# Altium schematic sheet receiver.SchDoc: MW Bench - Receiver
size A3; Organization: Altium Limited; Address1: L3, 12a Rodborough Rd; Address2: Frenchs Forest; Address3: NSW; Address4: Australia 2086; SheetNumber: 2; SheetTotal: 2
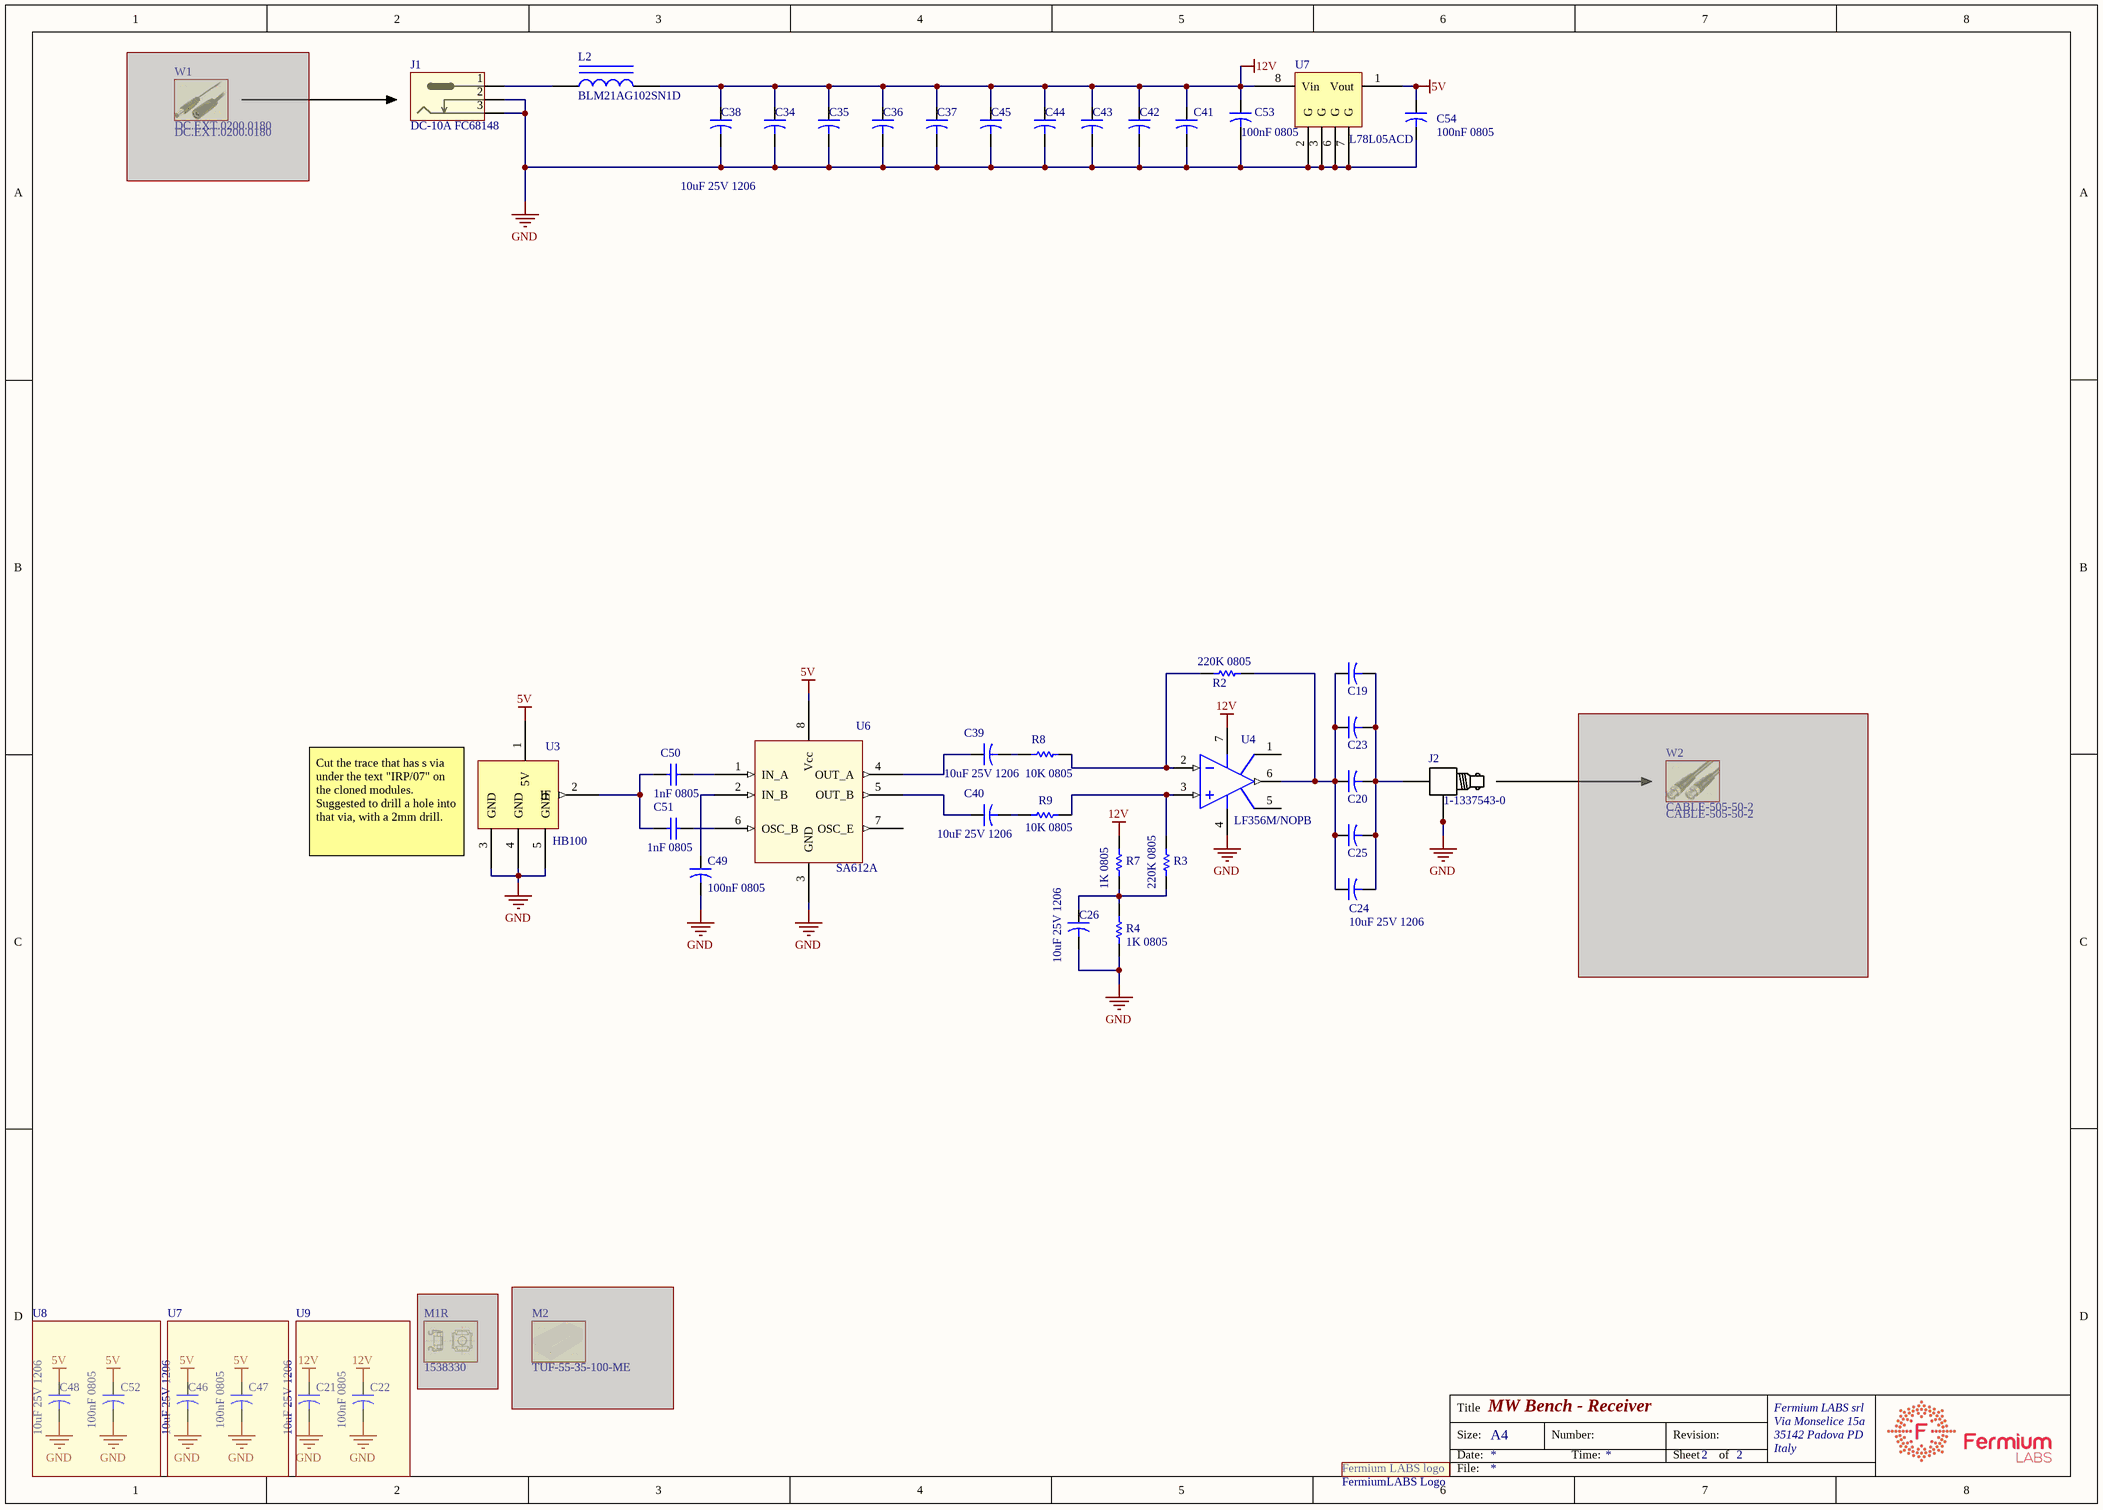
[diagram p0: receiver.SchDoc]

## Parts
C19  10uF 25V 1206  [CAP 1206_3216]  (value not drawn)
C20  10uF 25V 1206  [CAP 1206_3216]  (value not drawn)
C21  10uF 25V 1206  [CAP 1206_3216]
C22  100nF 0805  [CAP 0805_2012]
C23  10uF 25V 1206  [CAP 1206_3216]  (value not drawn)
C24  10uF 25V 1206  [CAP 1206_3216]
C25  10uF 25V 1206  [CAP 1206_3216]  (value not drawn)
C26  10uF 25V 1206  [CAP 1206_3216]
C34  10uF 25V 1206  [CAP 1206_3216]  (value not drawn)
C35  10uF 25V 1206  [CAP 1206_3216]  (value not drawn)
C36  10uF 25V 1206  [CAP 1206_3216]  (value not drawn)
C37  10uF 25V 1206  [CAP 1206_3216]  (value not drawn)
C38  10uF 25V 1206  [CAP 1206_3216]
C39  10uF 25V 1206  [CAP 1206_3216]
C40  10uF 25V 1206  [CAP 1206_3216]
C41  10uF 25V 1206  [CAP 1206_3216]  (value not drawn)
C42  10uF 25V 1206  [CAP 1206_3216]  (value not drawn)
C43  10uF 25V 1206  [CAP 1206_3216]  (value not drawn)
C44  10uF 25V 1206  [CAP 1206_3216]  (value not drawn)
C45  10uF 25V 1206  [CAP 1206_3216]  (value not drawn)
C46  10uF 25V 1206  [CAP 1206_3216]
C47  100nF 0805  [CAP 0805_2012]
C48  10uF 25V 1206  [CAP 1206_3216]
C49  100nF 0805  [CAP 0805_2012]
C50  1nF 0805  [CAP 0805_2012]
C51  1nF 0805  [CAP 0805_2012]
C52  100nF 0805  [CAP 0805_2012]
C53  100nF 0805  [CAP 0805_2012]
C54  100nF 0805  [CAP 0805_2012]
J1  DC-10A FC68148  [dc-jack]  (no BOM)
J2  1-1337543-0  [BNC-RA]
L2  BLM21AG102SN1D  [FER 0805_2012]
M1R  1538330  (mechanical)  (masked out: inside a compile mask, not in the netlist)
M2  TUF-55-35-100-ME  (mechanical)  (masked out: inside a compile mask, not in the netlist)
R2  220K 0805  [RES 0805_2012]
R3  220K 0805  [RES 0805_2012]
R4  1K 0805  [RES 0805_2012]
R7  1K 0805  [RES 0805_2012]
R8  10K 0805  [RES 0805_2012]
R9  10K 0805  [RES 0805_2012]
U3  HB100  [HB100-buried]
U4  LF356M/NOPB  [TI SOIC-8 D]
U6  SA612A  [TI SOIC-8 D]
U7  L78L05ACD  [ST SOIC-8N]
W1  DC.EXT.0200.0180  (mechanical)  (masked out: inside a compile mask, not in the netlist)
W2  CABLE-505-50-2  (mechanical)  (masked out: inside a compile mask, not in the netlist)
XX1  FermiumLABS Logo  [frm-med]  (no BOM)

## Blocks framed on the sheet
U8: C48 C52
U7: C46 C47
U9: C21 C22

## Nets
5V: C46.1 C47.1 C48.1 C52.1 C54.1 U3.1(5V) U6.8(Vcc) U7.1(Vout)
12V: C21.1 C22.1 C34.1 C35.1 C36.1 C37.1 C38.1 C41.1 C42.1 C43.1 C44.1 C45.1 C53.1 L2.2 R7.2 U4.7(VDD+) U7.8(Vin)
GND: C21.2 C22.2 C26.2 C34.2 C35.2 C36.2 C37.2 C38.2 C41.2 C42.2 C43.2 C44.2 C45.2 C46.2 C47.2 C48.2 C49.2 C52.2 C53.2 C54.2 J1.2 J1.3 J2.2(gnd) J2.A J2.B R4.1 U3.3(GND) U3.4(GND) U3.5(GND) U4.4(VDD-) U6.3(GND) U7.2(G) U7.3(G) U7.6(G) U7.7(G)
NetC19_1: C19.1 C20.1 C23.1 C24.1 C25.1 R2.2 U4.6(OUT)
NetC19_2: C19.2 C20.2 C23.2 C24.2 C25.2 J2.1
NetC26_1: C26.1 R3.1 R4.2 R7.1
NetC39_1: C39.1 U6.4(OUT_A)
NetC39_2: C39.2 R8.1
NetC40_1: C40.1 U6.5(OUT_B)
NetC40_2: C40.2 R9.1
NetC49_1: C49.1 U6.2(IN_B)
NetC50_1: C50.1 C51.1 U3.2(IF)
NetC50_2: C50.2 U6.1(IN_A)
NetC51_2: C51.2 U6.6(OSC_B)
NetJ1_1: J1.1 L2.1
NetR2_1: R2.1 R8.2 U4.2(IN-)
NetR3_2: R3.2 R9.2 U4.3(IN+)

Not connected (* = marked no-connect by the designer): U4 1(CXA) 5; U6 7(OSC_E)

## Notes on the sheet
- (near U3) Cut the trace that has s via under the text "IRP/07" on the cloned modules. Suggested to drill a hole into that via, with a 2mm drill.
- Title
- Size:
- Date:
- A4
- Number:
- Time:
- Revision:
- Sheet
- of
- Fermium LABS srl
- Via Monselice 15a
- 35142 Padova PD
- Italy
- File:
- (in symbol fermiumlabs-logo) Fermium LABS logo

## Library data of the parts
C19-C21 C23-C26 C34-C46 C48 = C10uF: Capacitor; Manufacturer: SAMSUNG; Manufacturer Part Number: CL31A106KAHNNNE; Part Number: C10uF
C22 C47 C49 C52-C54 = C100nF: Capacitor; Manufacturer: YAGEO; Manufacturer Part Number: CC0805JRX7R9BB104; Part Number: C100nF
C50 C51 = C1nF: Capacitor; Manufacturer: Samsung; Manufacturer Part Number: CL21B102KCANNNC; Part Number: C1nF
J1 = jackdc: Manufacturer: CLIFF; Manufacturer Part Number: DC-10A FC68148; Part Number: jackdc
J2 = BNC-PCB-RA: connector bnc; Manufacturer: TE CONNECTIVITY; Manufacturer Part Number: 1-1337543-0; Part Number: BNC-PCB-RA
L2 = Inductor Iron: Magnetic-Core Inductor; Manufacturer: Murata; Manufacturer Part Number: BLM21AG102SN1D; Part Number: Inductor Iron
M1R = B6/0.7-1.6/BN3307: Manufacturer: Bossard; Part Number: B6/0.7-1.6/BN3307; Manufacturer Part Number: 1538330
R2 R3 = R220K: Resistor; Manufacturer: Vishay; Manufacturer Part Number: CRCW0805220KFKEA; Part Number: R220K
R4 R7 = R1K: Resistor; Manufacturer: Royal Electronic Factory; Manufacturer Part Number: 0805S8J0102T5E; Part Number: R1K
R8 R9 = R10K: Resistor; Manufacturer: Royal Electronic Factory; Manufacturer Part Number: 0805S8J0103T5E; Part Number: R10K
U3 = HB100: Manufacturer: China unspecified; Manufacturer Part Number: HB100; Part Number: HB100
U4 = LF358: Manufacturer: Texas Instruments; Part Number: LF358; Manufacturer Part Number: LF356M/NOPB
U6 = SA612A: Manufacturer: NXP; Manufacturer Part Number: SA612AD; Supplier 1: TME; Supplier 2: Mouser; Supplier Part Number 2: 771-SA612AD01112; Supplier Part Number 1: SA612AD
U7 = L78L05ACD: Manufacturer: ST Microelectronics; Part Number: L78L05ACD; Manufacturer Part Number: L78L05ACD
XX1 = fermiumlabs-logo: Part Number: fermiumlabs-logo
M2 = TUF-55-35-100-ME: Supplier 1: TME; Supplier Part Number 1: TUF-55-35-100-ME
W1 = DC.EXT.0200.0180: Supplier 1: TME; Supplier Part Number 1: DC.EXT.0200.0180
W2 = CABLE-505-50-2: Supplier 1: TME; Supplier Part Number 1: CABLE-505-50-2